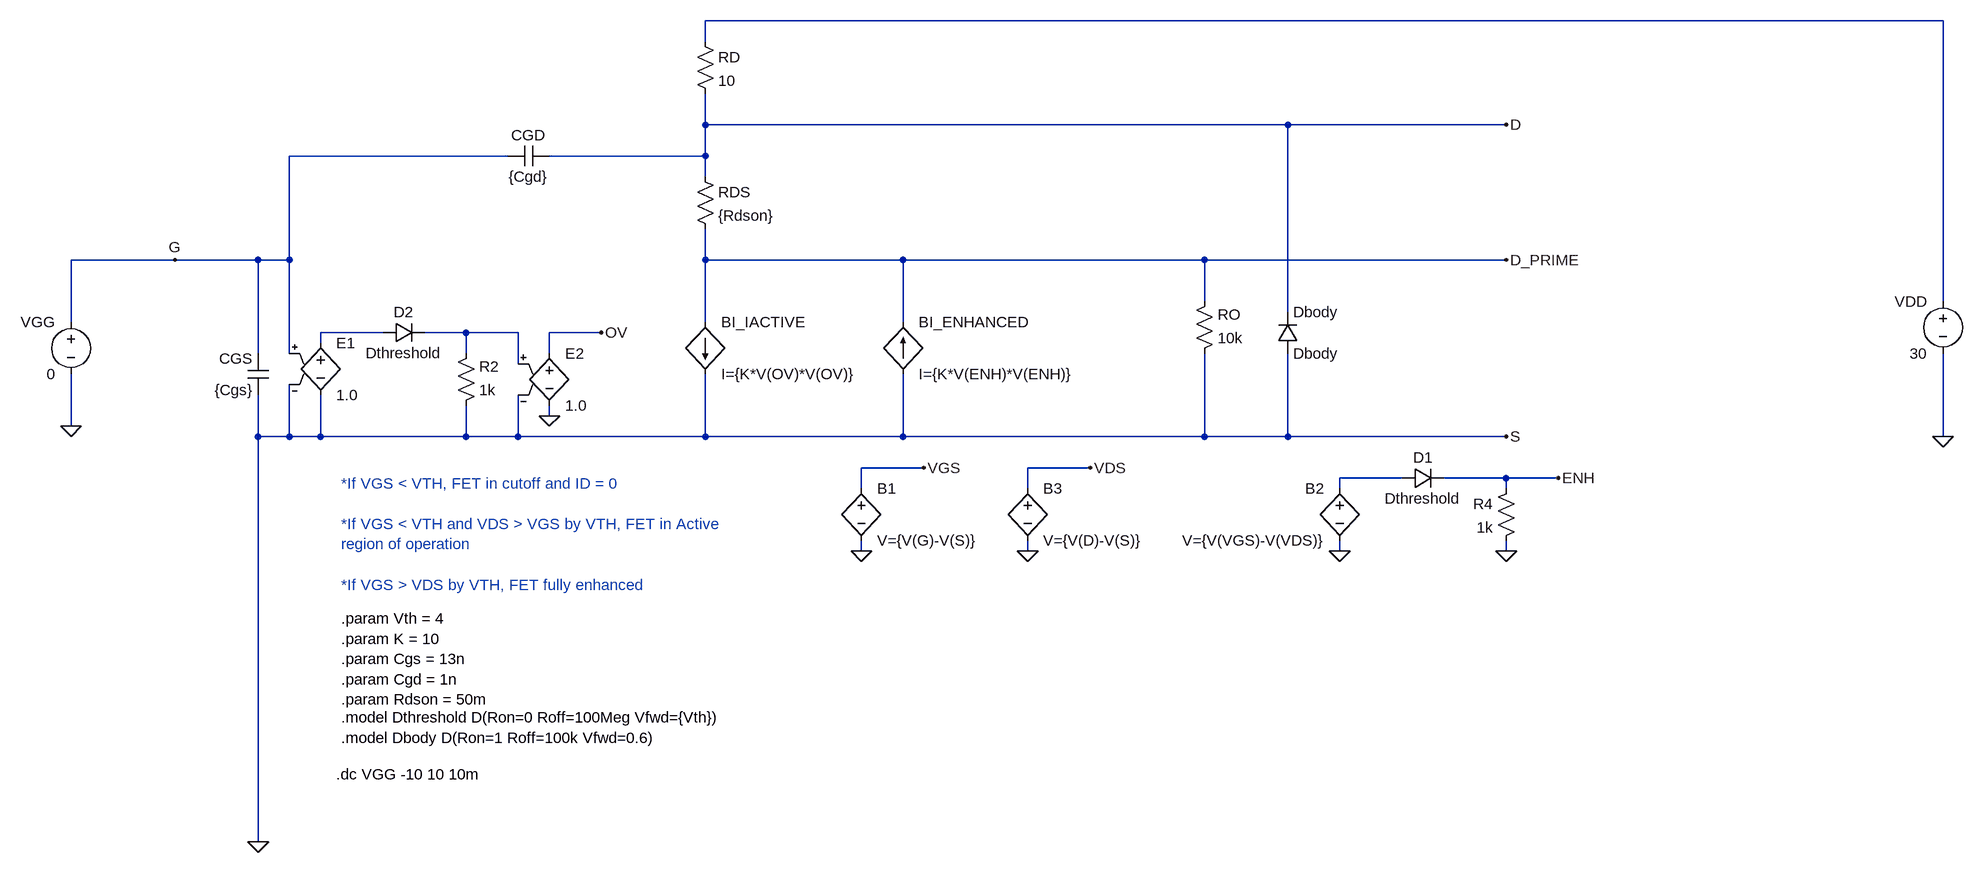
[diagram p0: schematic Ideal_NCHAN_MOSFET_Model.asc]
Ideal_NCHAN_MOSFET_Model.asc, the LTspice schematic file:
Version 4.1
SHEET 1 2916 1364
WIRE 2880 80 976 80
WIRE 976 112 976 80
WIRE 976 240 976 192
WIRE 1872 240 976 240
WIRE 2208 240 1872 240
WIRE 672 288 336 288
WIRE 976 288 976 240
WIRE 976 288 736 288
WIRE 976 320 976 288
WIRE 160 448 0 448
WIRE 288 448 160 448
WIRE 336 448 336 288
WIRE 336 448 288 448
WIRE 976 448 976 400
WIRE 1280 448 976 448
WIRE 1744 448 1280 448
WIRE 2208 448 1744 448
WIRE 1744 512 1744 448
WIRE 2880 512 2880 80
WIRE 1872 528 1872 240
WIRE 0 544 0 448
WIRE 976 544 976 448
WIRE 1280 544 1280 448
WIRE 480 560 384 560
WIRE 608 560 544 560
WIRE 688 560 608 560
WIRE 816 560 736 560
WIRE 384 576 384 560
WIRE 288 592 288 448
WIRE 336 592 336 448
WIRE 608 592 608 560
WIRE 736 592 736 560
WIRE 688 608 688 560
WIRE 736 688 736 672
WIRE 0 704 0 624
WIRE 288 720 288 656
WIRE 336 720 336 640
WIRE 336 720 288 720
WIRE 384 720 384 656
WIRE 384 720 336 720
WIRE 608 720 608 672
WIRE 608 720 384 720
WIRE 688 720 688 656
WIRE 688 720 608 720
WIRE 976 720 976 624
WIRE 976 720 688 720
WIRE 1280 720 1280 624
WIRE 1280 720 976 720
WIRE 1744 720 1744 592
WIRE 1744 720 1280 720
WIRE 1872 720 1872 592
WIRE 1872 720 1744 720
WIRE 2208 720 1872 720
WIRE 2880 720 2880 592
WIRE 1312 768 1216 768
WIRE 1568 768 1472 768
WIRE 2048 784 1952 784
WIRE 2208 784 2112 784
WIRE 2288 784 2208 784
WIRE 1216 800 1216 768
WIRE 1472 800 1472 768
WIRE 1952 800 1952 784
WIRE 2208 800 2208 784
WIRE 1216 896 1216 880
WIRE 1472 896 1472 880
WIRE 1952 896 1952 880
WIRE 2208 896 2208 880
WIRE 288 1344 288 720
FLAG 0 704 0
FLAG 2880 720 0
FLAG 2208 448 D_PRIME
FLAG 2208 720 S
FLAG 160 448 G
FLAG 288 1344 0
FLAG 816 560 OV
FLAG 736 688 0
FLAG 2208 240 D
FLAG 2208 896 0
FLAG 1952 896 0
FLAG 2288 784 ENH
FLAG 1216 896 0
FLAG 1312 768 VGS
FLAG 1472 896 0
FLAG 1568 768 VDS
SYMBOL e 384 560 R0
SYMATTR InstName E1
SYMATTR Value 1.0
SYMBOL res 592 688 M180
WINDOW 0 36 76 Left 2
WINDOW 3 36 40 Left 2
SYMATTR InstName R2
SYMATTR Value 1k
SYMBOL diode 480 544 M90
WINDOW 0 0 32 VBottom 2
WINDOW 3 32 32 VTop 2
SYMATTR InstName D2
SYMATTR Value Dthreshold
SYMBOL voltage 0 528 M0
WINDOW 123 0 0 Left 0
WINDOW 39 0 0 Left 0
SYMATTR InstName VGG
SYMATTR Value 0
SYMBOL voltage 2880 496 M0
WINDOW 123 0 0 Left 0
WINDOW 39 0 0 Left 0
SYMATTR InstName VDD
SYMATTR Value 30
SYMBOL cap 304 656 R180
WINDOW 0 24 56 Left 2
WINDOW 3 24 8 Left 2
SYMATTR InstName CGS
SYMATTR Value {Cgs}
SYMBOL cap 672 304 R270
WINDOW 0 32 32 VTop 2
WINDOW 3 0 32 VBottom 2
SYMATTR InstName CGD
SYMATTR Value {Cgd}
SYMBOL res 1728 608 M180
WINDOW 0 36 76 Left 2
WINDOW 3 36 40 Left 2
SYMATTR InstName RO
SYMATTR Value 10k
SYMBOL e 736 576 R0
SYMATTR InstName E2
SYMATTR Value 1.0
SYMBOL bi 976 544 R0
SYMATTR InstName BI_IACTIVE
SYMATTR Value I={K*V(OV)*V(OV)}
SYMBOL bv 1952 784 M0
SYMATTR InstName B2
SYMATTR Value V={V(VGS)-V(VDS)}
SYMBOL res 960 304 R0
SYMATTR InstName RDS
SYMATTR Value {Rdson}
SYMBOL diode 2048 800 R270
WINDOW 0 32 32 VTop 2
WINDOW 3 0 32 VBottom 2
SYMATTR InstName D1
SYMATTR Value Dthreshold
SYMBOL res 2224 784 M0
SYMATTR InstName R4
SYMATTR Value 1k
SYMBOL bi 1280 624 M180
WINDOW 0 24 80 Left 2
WINDOW 3 24 0 Left 2
SYMATTR InstName BI_ENHANCED
SYMATTR Value I={K*V(ENH)*V(ENH)}
SYMBOL res 960 96 R0
SYMATTR InstName RD
SYMATTR Value 10
SYMBOL bv 1216 784 R0
SYMATTR InstName B1
SYMATTR Value V={V(G)-V(S)}
SYMBOL bv 1472 784 R0
SYMATTR InstName B3
SYMATTR Value V={V(D)-V(S)}
SYMBOL diode 1856 592 M180
WINDOW 0 24 64 Left 2
WINDOW 3 24 0 Left 2
SYMATTR InstName Dbody
SYMATTR Value Dbody
TEXT 408 1240 Left 2 !.dc VGG -10 10 10m
TEXT 416 1000 Left 2 !.param Vth = 4\n.param K = 10\n.param Cgs = 13n\n.param Cgd = 1n\n.param Rdson = 50m
TEXT 416 1152 Left 2 !.model Dthreshold D(Ron=0 Roff=100Meg Vfwd={Vth})
TEXT 416 792 Left 2 ;*If VGS < VTH, FET in cutoff and ID = 0\n \n*If VGS < VTH and VDS > VGS by VTH, FET in Active\nregion of operation\n \n*If VGS > VDS by VTH, FET fully enhanced
TEXT 416 1184 Left 2 !.model Dbody D(Ron=1 Roff=100k Vfwd=0.6)

The netlist it stands for:
* Ideal_NCHAN_MOSFET_Model.asc
E1 N002 0 G 0 1.0
R2 0 N003 1k
D2 N002 N003 Dthreshold
VGG G 0 0
VDD N001 0 30
CGS 0 G {Cgs}
CGD G D {Cgd}
RO 0 D_PRIME 10k
E2 OV 0 N003 0 1.0
BI_IACTIVE D_PRIME 0 I={K*V(OV)*V(OV)}
B2 N004 0 V={V(VGS)-V(VDS)}
RDS D D_PRIME {Rdson}
D1 N004 ENH Dthreshold
R4 ENH 0 1k
BI_ENHANCED 0 D_PRIME I={K*V(ENH)*V(ENH)}
RD N001 D 10
B1 VGS 0 V={V(G)-V(S)}
B3 VDS 0 V={V(D)-V(S)}
Dbody 0 D Dbody
.model D D
.lib standard.dio
.dc VGG -10 10 10m
.param Vth = 4
.param K = 10
.param Cgs = 13n
.param Cgd = 1n
.param Rdson = 50m
.model Dthreshold D(Ron=0 Roff=100Meg Vfwd={Vth})
* *If VGS < VTH, FET in cutoff and ID = 0
* *If VGS < VTH and VDS > VGS by VTH, FET in Active
* region of operation
* *If VGS > VDS by VTH, FET fully enhanced
.model Dbody D(Ron=1 Roff=100k Vfwd=0.6)
.backanno
.end